# Altium schematic sheet Cover.SchDoc: Wireles Securty Detector
size 420 x 297 mm; Date: 06.12.2023; CheckedBy: Arda B.; DrawnBy: Arda BOZKURT; DocumentNumber: 1; Revision: 001; SheetNumber: 1; SheetTotal: 5; ENG_APP_DATE: --/--/--; DSN_APP_DATE: --/--/--; CHK_APP_DATE: --/--/--; Size: A3; Department: HDD
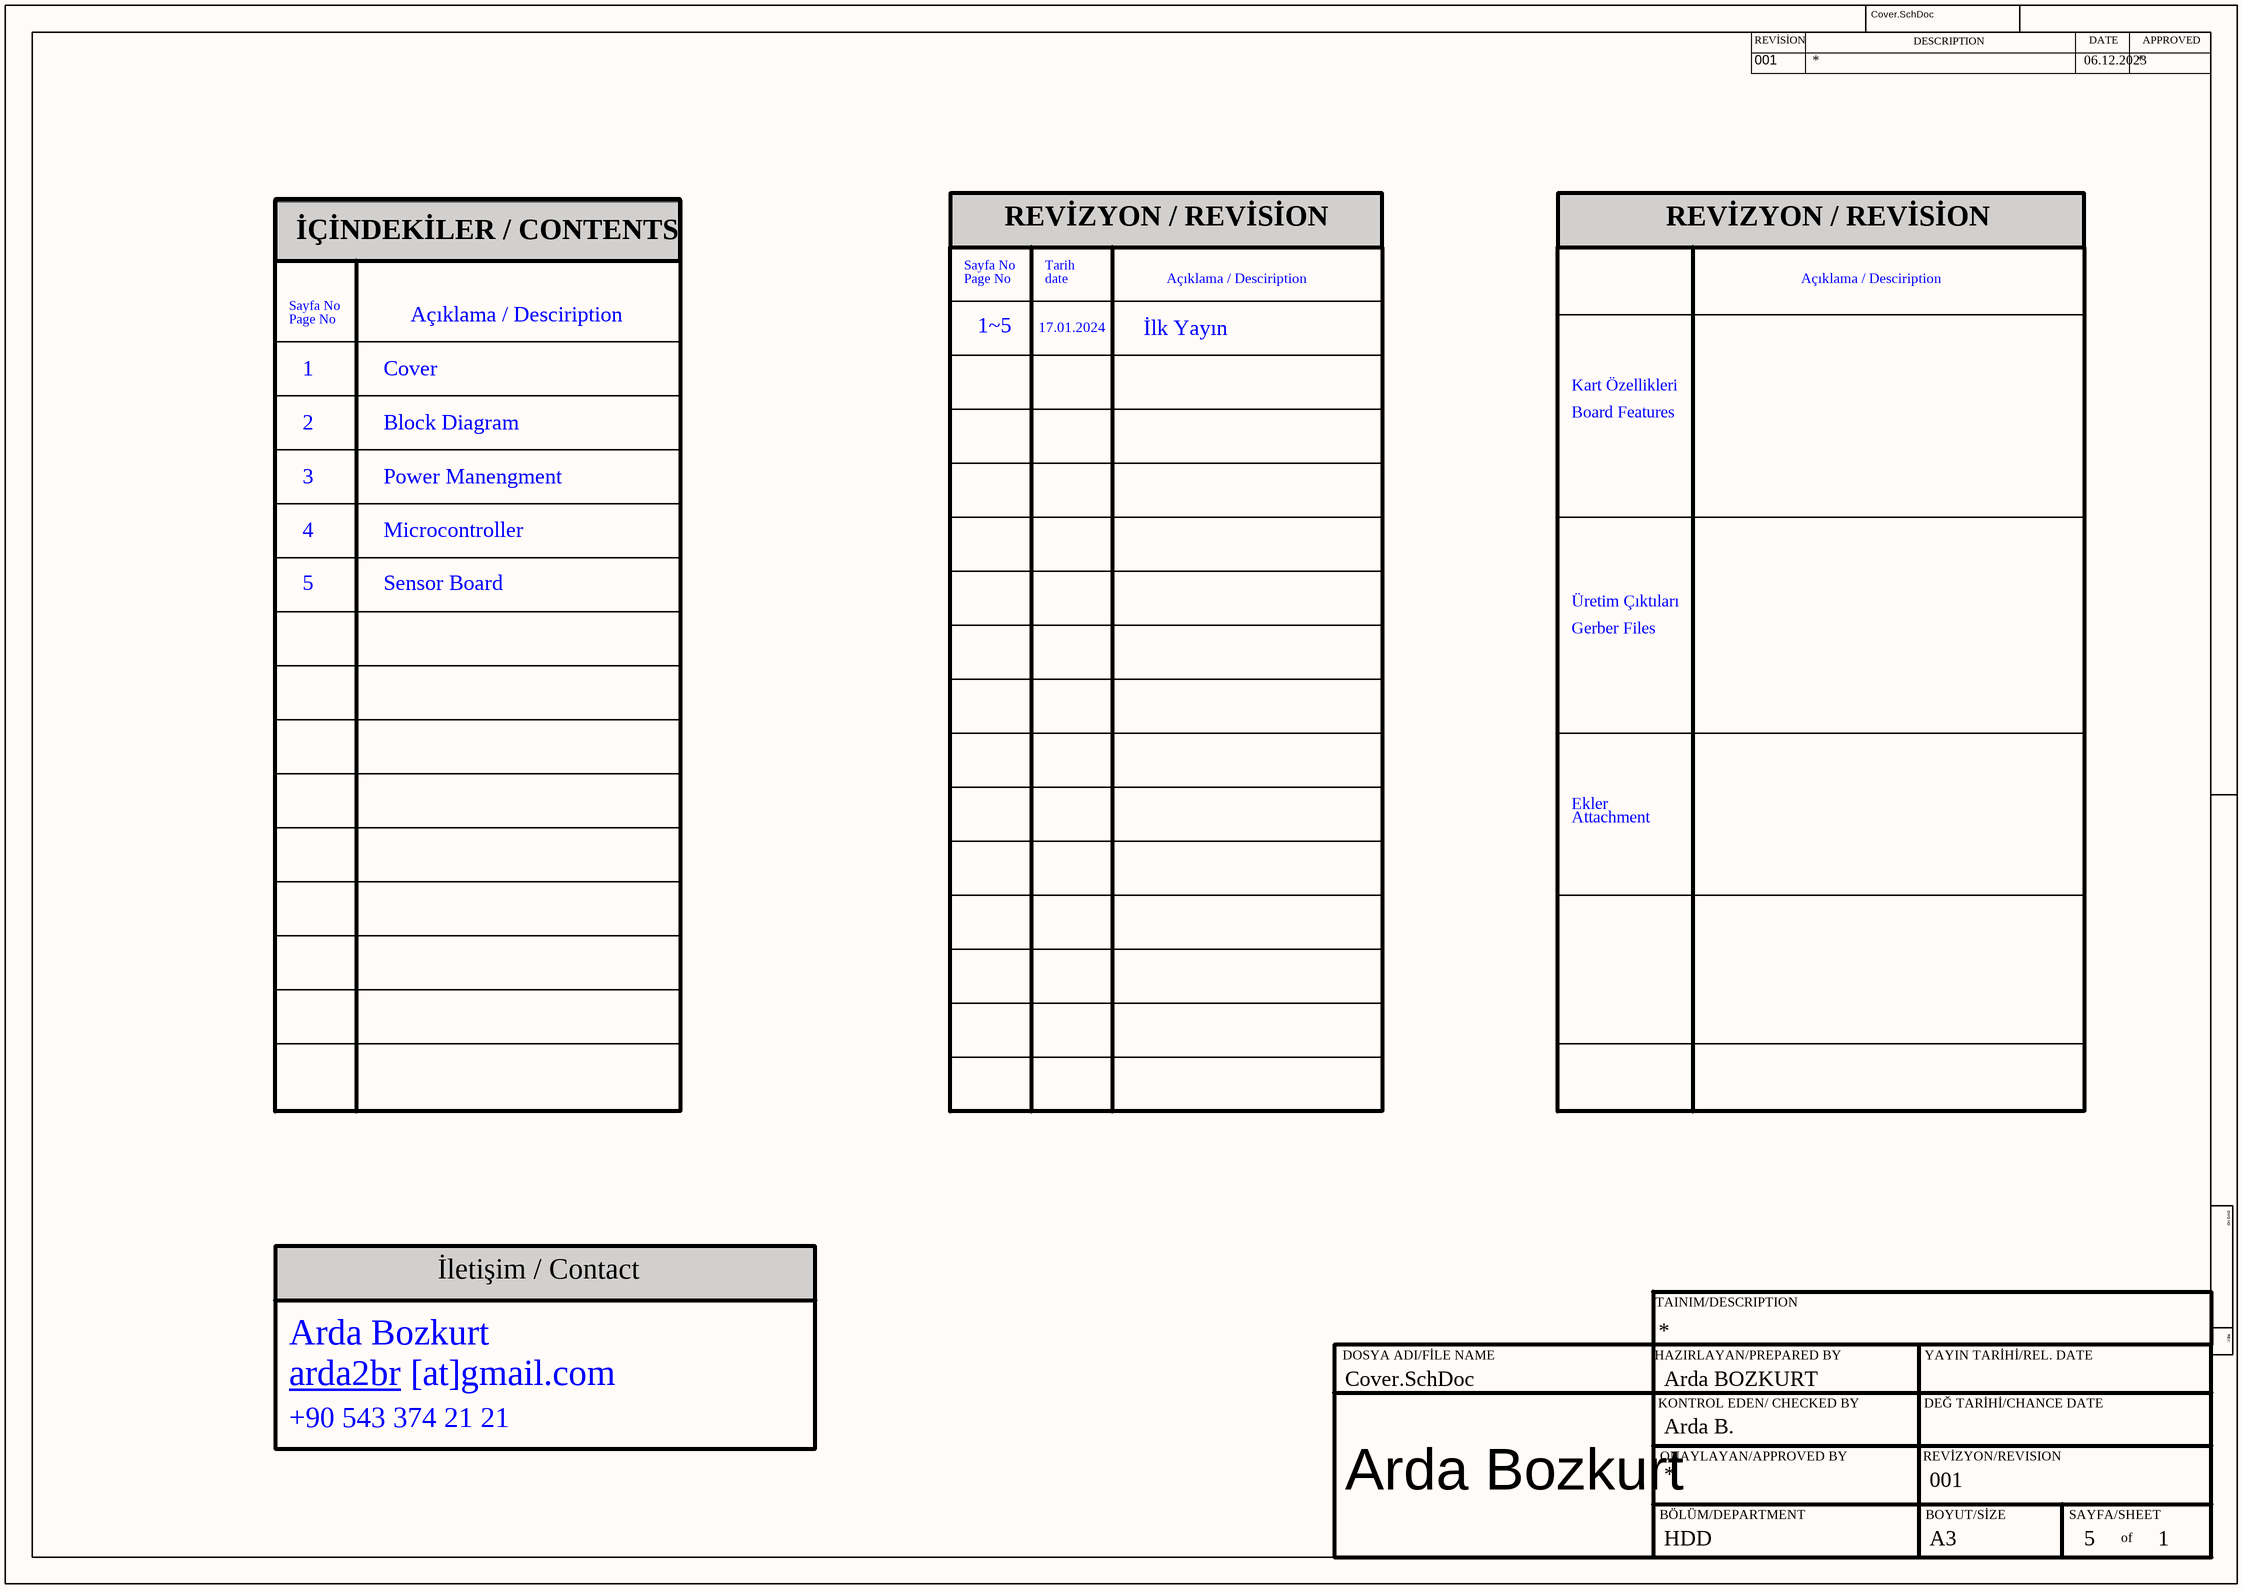
[diagram p0: Cover.SchDoc]

## Notes on the sheet
- İÇİNDEKİLER / CONTENTS
- REVİZYON / REVİSİON
- Page No
- Sayfa No
- Açıklama / Desciription
- date
- Tarih
- 1
- Cover
- 1~5
- 17.01.2024
- İlk Yayın
- Kart Özellikleri
- 2
- Block Diagram
- Board Features
- 3
- Power Manengment
- 4
- 5
- Microcontroller
- Sensor Board
- Üretim Çıktıları
- Gerber Files
- Ekler
- Attachment
- İletişim / Contact
- Arda Bozkurt
- arda2br
- [at]gmail.com
- +90 543 374 21 21
- REVİSİON
- DESCRIPTION
- DATE
- APPROVED
- DWG NO:
- TAINIM/DESCRIPTION
- REV:
- DOSYA ADI/FİLE NAME
- HAZIRLAYAN/PREPARED BY
- KONTROL EDEN/ CHECKED BY
- YAYIN TARİHİ/REL. DATE
- DEĞ TARİHİ/CHANCE DATE
- ONAYLAYAN/APPROVED BY
- REVİZYON/REVISION
- BÖLÜM/DEPARTMENT
- BOYUT/SİZE
- SAYFA/SHEET
- of